# Altium project LM317-LM337.PrjPcb
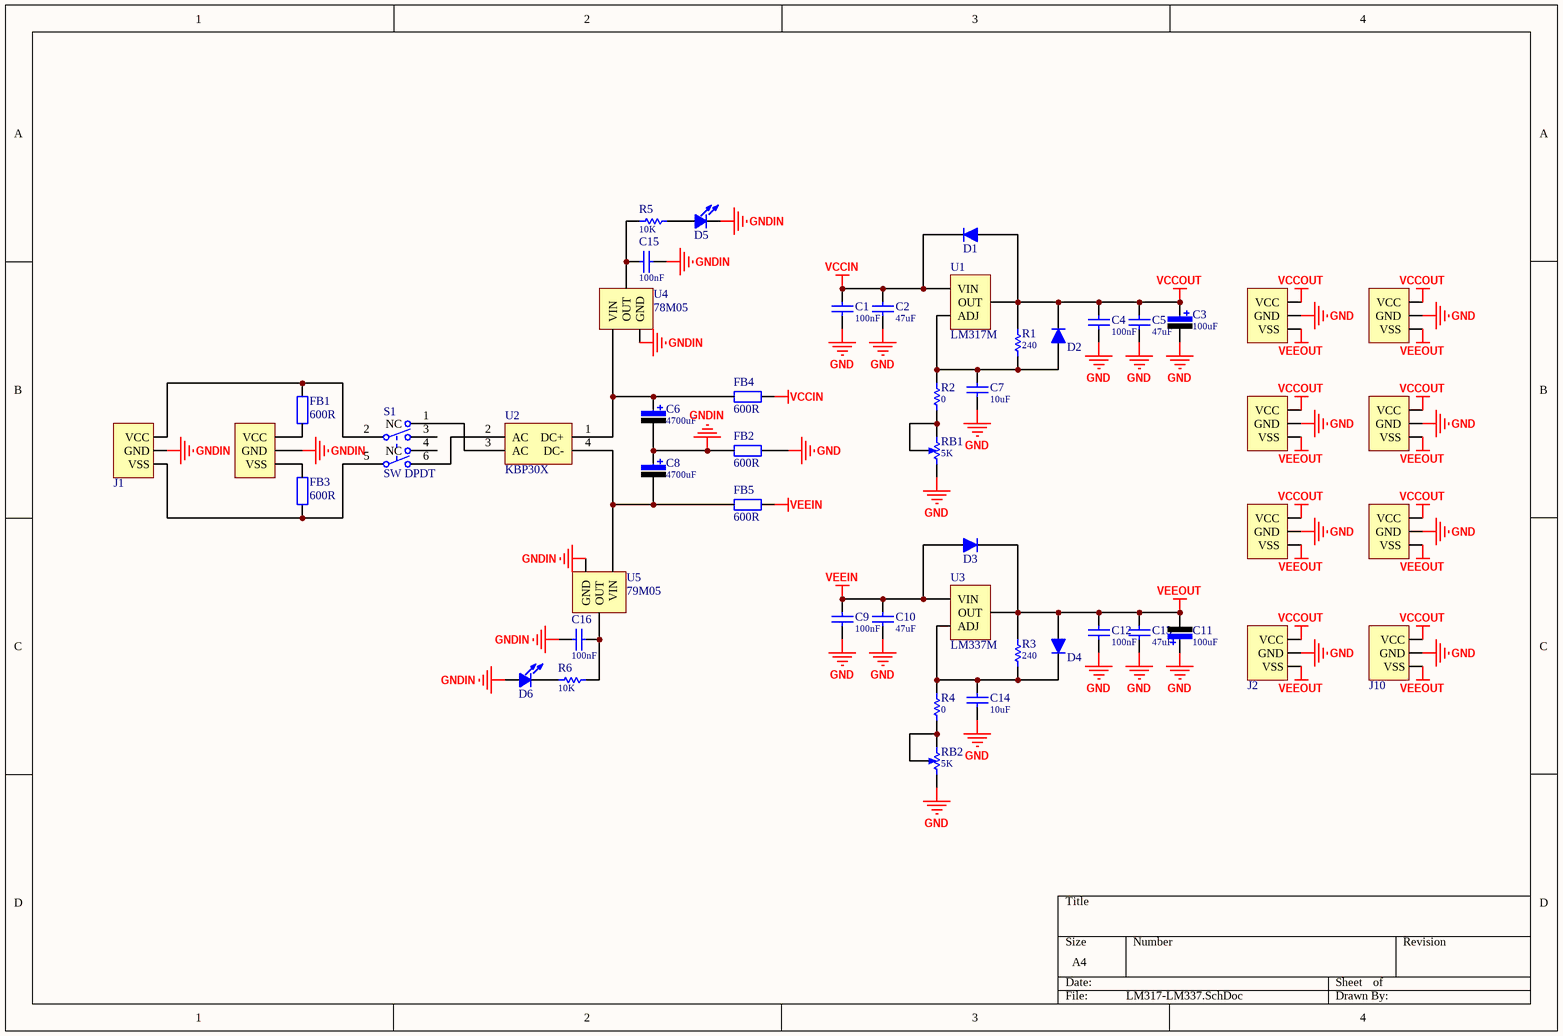
[diagram p0: LM317-LM337.SchDoc]
1 sheet, 51 parts. Net scope: global (net labels, ports and power ports of the same name join across sheets).
Board file: LM317-LM337.PcbDoc

## Sheet LM317-LM337.SchDoc
size A4

### Parts
C1  value 100nF  [C0603-L]  (hidden comment: Cap-S)
C2  value 47uF  [C0805-L]  (hidden comment: Cap-S)
C3  value 100uF  [C-DIP-10]  (hidden comment: C)
C4  value 100nF  [C0603-L]  (hidden comment: Cap-S)
C5  value 47uF  [C0805-L]  (hidden comment: Cap-S)
C6  value 4700uF  [C-DIP-20]  (hidden comment: C)
C7  value 10uF  [C0603-L]  (hidden comment: Cap-S)
C8  value 4700uF  [C-DIP-20]  (hidden comment: C)
C9  value 100nF  [C0603-L]  (hidden comment: Cap-S)
C10  value 47uF  [C0805-L]  (hidden comment: Cap-S)
C11  value 100uF  [C-DIP-10]  (hidden comment: C)
C12  value 100nF  [C0603-L]  (hidden comment: Cap-S)
C13  value 47uF  [C0805-L]  (hidden comment: Cap-S)
C14  value 10uF  [C0603-L]  (hidden comment: Cap-S)
C15  value 100nF  [C0603-L]  (hidden comment: Cap-S)
C16  value 100nF  [C0603-L]  (hidden comment: Cap-S)
D1  D  [D-SMA]  (value not drawn)
D2  D  [D-SMA]  (value not drawn)
D3  D  [D-SMA]  (value not drawn)
D4  D  [D-SMA]  (value not drawn)
D5  LED  [Led-0805_L]  (value not drawn)
D6  LED  [Led-0805_L]  (value not drawn)
FB1  600R  [FB-0805]
FB2  600R  [FB-0805]
FB3  600R  [FB-0805]
FB4  600R  [FB-0805]
FB5  600R  [FB-0805]
J1  接线座-3P  [KF128-5.08-3P]  (value not drawn)
J2  接线座-3P  [KF128-5.08-3P]  (value not drawn)
J3  Power-3P  [SIPA03]  (value not drawn)
J4  Power-3P  [SIPA03]  (value not drawn)
J5  Power-3P  [SIPA03]  (value not drawn)
J6  Power-3P  [SIPA03]  (value not drawn)
J7  Power-3P  [SIPA03]  (value not drawn)
J8  Power-3P  [SIPA03]  (value not drawn)
J9  Power-3P  [SIPA03]  (value not drawn)
J10  接线座-3P  [KF128-5.08-3P]  (value not drawn)
R1  value 240  [R0603-L]  (hidden comment: R)
R2  value 0  [R0603-L]  (hidden comment: R)
R3  value 240  [R0603-L]  (hidden comment: R)
R4  value 0  [R0603-L]  (hidden comment: R)
R5  value 10K  [R0603-L]  (hidden comment: R)
R6  value 10K  [R0603-L]  (hidden comment: R)
RB1  value 5K  [R_VR-3296W]  (hidden comment: R)
RB2  value 5K  [R_VR-3296W]  (hidden comment: R)
S1  SW DPDT  [SW_DPDT]
U1  LM317M  [TO-263-2]
U2  KBP30X  [Bridge]
U3  LM337M  [TO-263-2]
U4  78M05  [TO-252]
U5  79M05  [TO-252]

### Nets
GND: C1.1 C2.1 C3.2 C4.1 C5.1 C7.1 C9.1 C10.1 C11.1 C12.1 C13.1 C14.1 FB2.2 J2.2(GND) J4.2(GND) J5.2(GND) J6.2(GND) J7.2(GND) J8.2(GND) J9.2(GND) J10.2(GND) RB1.1 RB2.1
GNDIN: C6.2 C8.1 C15.1 C16.1 D5.2 D6.1 FB2.1 J1.2(GND) J3.2(GND) U4.2(GND) U5.1(GND)
VCCIN: C1.2 C2.2 D1.2 FB4.2 U1.3(VIN)
VCCOUT: C3.1 C4.2 C5.2 D1.1 D2.2 J2.1(VCC) J4.1(VCC) J5.1(VCC) J6.1(VCC) J7.1(VCC) J8.1(VCC) J9.1(VCC) J10.1(VCC) R1.1 U1.2(OUT)
VEEIN: C9.2 C10.2 D3.1 FB5.2 U3.2(VIN)
VEEOUT: C11.2 C12.2 C13.2 D3.2 D4.1 J2.3(VSS) J4.3(VSS) J5.3(VSS) J6.3(VSS) J7.3(VSS) J8.3(VSS) J9.3(VSS) J10.3(VSS) R3.1 U3.3(OUT)
NetC6_1: C6.1 FB4.1 U2.1(DC+) U4.1(VIN)
NetC7_2: C7.2 D2.1 R1.2 R2.1 U1.1(ADJ)
NetC8_2: C8.2 FB5.1 U2.4(DC-) U5.2(VIN)
NetC14_2: C14.2 D4.2 R3.2 R4.1 U3.1(ADJ)
NetC15_2: C15.2 R5.1 U4.3(OUT)
NetC16_2: C16.2 R6.2 U5.3(OUT)
NetD5_1: D5.1 R5.2
NetD6_2: D6.2 R6.1
NetFB1_1: FB1.1 J3.1(VCC)
NetFB1_2: FB1.2 J1.1(VCC) S1.2
NetFB3_1: FB3.1 J3.3(VSS)
NetFB3_2: FB3.2 J1.3(VSS) S1.5(COMMON2)
NetR2_2: R2.2 RB1.2 RB1.3
NetR4_2: R4.2 RB2.2 RB2.3
NetS1_1: S1.1(NC) U2.3(AC)
NetS1_6: S1.6(NO2) U2.2(AC)

Not connected (* = marked no-connect by the designer): S1 3(NO1) 4(NC)

### Library data of the parts
C1 C2 C4 C5 C7 C9 C10 C12-C16 = Cap-S: 贴片瓷片电容
C3 C6 C8 C11 = Cap-Pol-ER: 极性直插电解电容
D1-D4 = Diode: 二极管
D5 D6 = LED: 发光二极管
FB1-FB5 = FB
J3-J9 = Power-3P: 供电端子
R1-R6 = Res: 贴片电阻
RB1 RB2 = Res_Val: 可调电阻
S1 = SW DPDT: 自锁开关; Published: 24-Mar-1999; LatestRevisionDate: 29-May-2009; LatestRevisionNote: IPC-7351 Footprint Added.; PackageVersion: Mar-2001; PackageReference: SOT23-6; Publisher: Altium Limited; PackageDescription: 6-Pin SOT-23 Package 0.95 mm Pitch, 2.7 mm Lead Span; Code_JEITA: SC-74; Code_IPC: SOT26A-6
U2 = Bridge